# EAGLE schematic powerboard 3.3V, 5V (EAGLE 9.4.2)
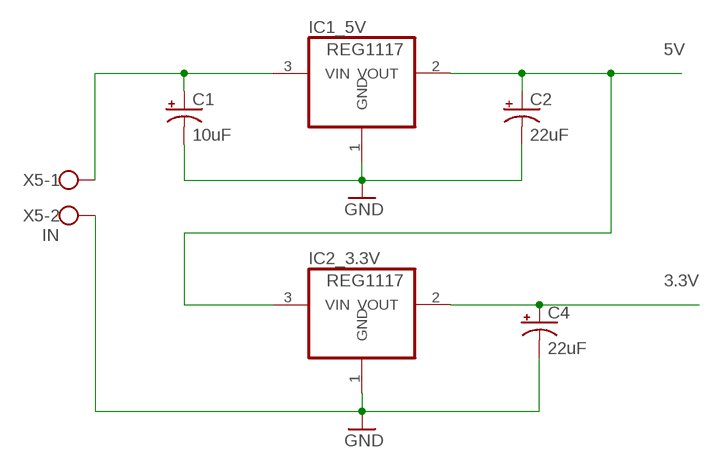
[diagram p0: schematic, sheet 1]

## Parts
C1  10uF  10UF-POLAR-EIA3216-16V-10%(TANT)  [EIA3216]
C2  22uF  10UF-POLAR-EIA3528-20V-10%(TANT)  [EIA3528]
C4  22uF  10UF-POLAR-EIA3528-20V-10%(TANT)  [EIA3528]
IC1_5V  REG1117  [SOT223]
IC2_3.3V  REG1117  [SOT223]
X5  IN  W237-102  [W237-102]

## Nets
3.3V [power]: C4.A(+) IC2_3.3V.2(VOUT)
5V [power]: C2.A(+) IC1_5V.2(VOUT) IC2_3.3V.3(VIN)
GND [power]: C1.- C2.C(-) C4.C(-) IC1_5V.1(GND) IC2_3.3V.1(GND) X5.2
VIN [power]: C1.+ IC1_5V.3(VIN) X5.1

## Library data of the parts
C1 = SparkFun-Capacitors:10UF-POLAR: 10.0µF polarized capacitors A capacitor is a passive two-terminal electrical component used to store electrical energy temporarily in an electric field.; PROD_ID: CAP-00811
C2 C4 = SparkFun-Capacitors:10UF-POLAR: 10.0µF polarized capacitors A capacitor is a passive two-terminal electrical component used to store electrical energy temporarily in an electric field.; PROD_ID: CAP-08063; VALUE: 10uF
IC1_5V IC2_3.3V = burr-brown:REG1117: 800mA and 1A Low Dropout (LDO) Positive Regulator 1.8V, 2.5V, 2.85V, 3.3V, 5V, and Adj; MPN: REG1117; OC_FARNELL: 1097566; OC_NEWARK: 14P6981
X5 = con-wago-500:W237-102: WAGO SCREW CLAMP; MPN: 237-102; OC_FARNELL: unknown; OC_NEWARK: 70K9898

## Net classes
1 power: width 1 mm